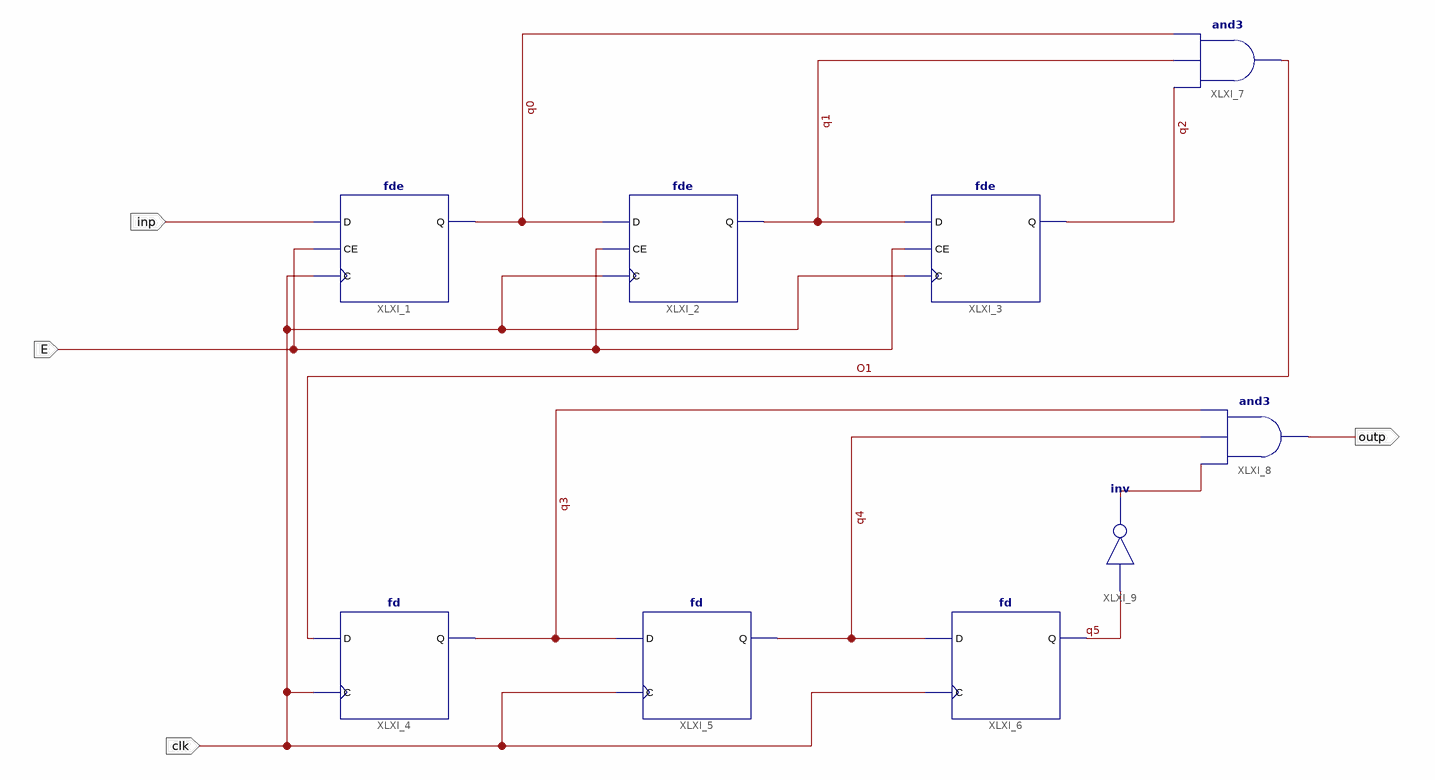
[diagram p0: schematic sheet 1]
// Xilinx ISE schematic pulse.sch (spartan6) as structural Verilog: 9 symbols, 4 ports
module pulse (
  input  inp,
  input  clk,
  input  E,
  output outp
);

  wire O1, q0, q1, q2, q3, q4, q5, XLXN_2;

  fde XLXI_1 (.C(clk), .CE(E), .D(inp), .Q(q0));
  fde XLXI_2 (.C(clk), .CE(E), .D(q0), .Q(q1));
  fde XLXI_3 (.C(clk), .CE(E), .D(q1), .Q(q2));
  fd XLXI_4 (.C(clk), .D(O1), .Q(q3));
  fd XLXI_5 (.C(clk), .D(q3), .Q(q4));
  fd XLXI_6 (.C(clk), .D(q4), .Q(q5));
  and XLXI_7 (O1, q2, q1, q0);
  and XLXI_8 (outp, XLXN_2, q4, q3);
  not XLXI_9 (XLXN_2, q5);
endmodule
